# Altium schematic sheet Sheet2.SchDoc
size A3
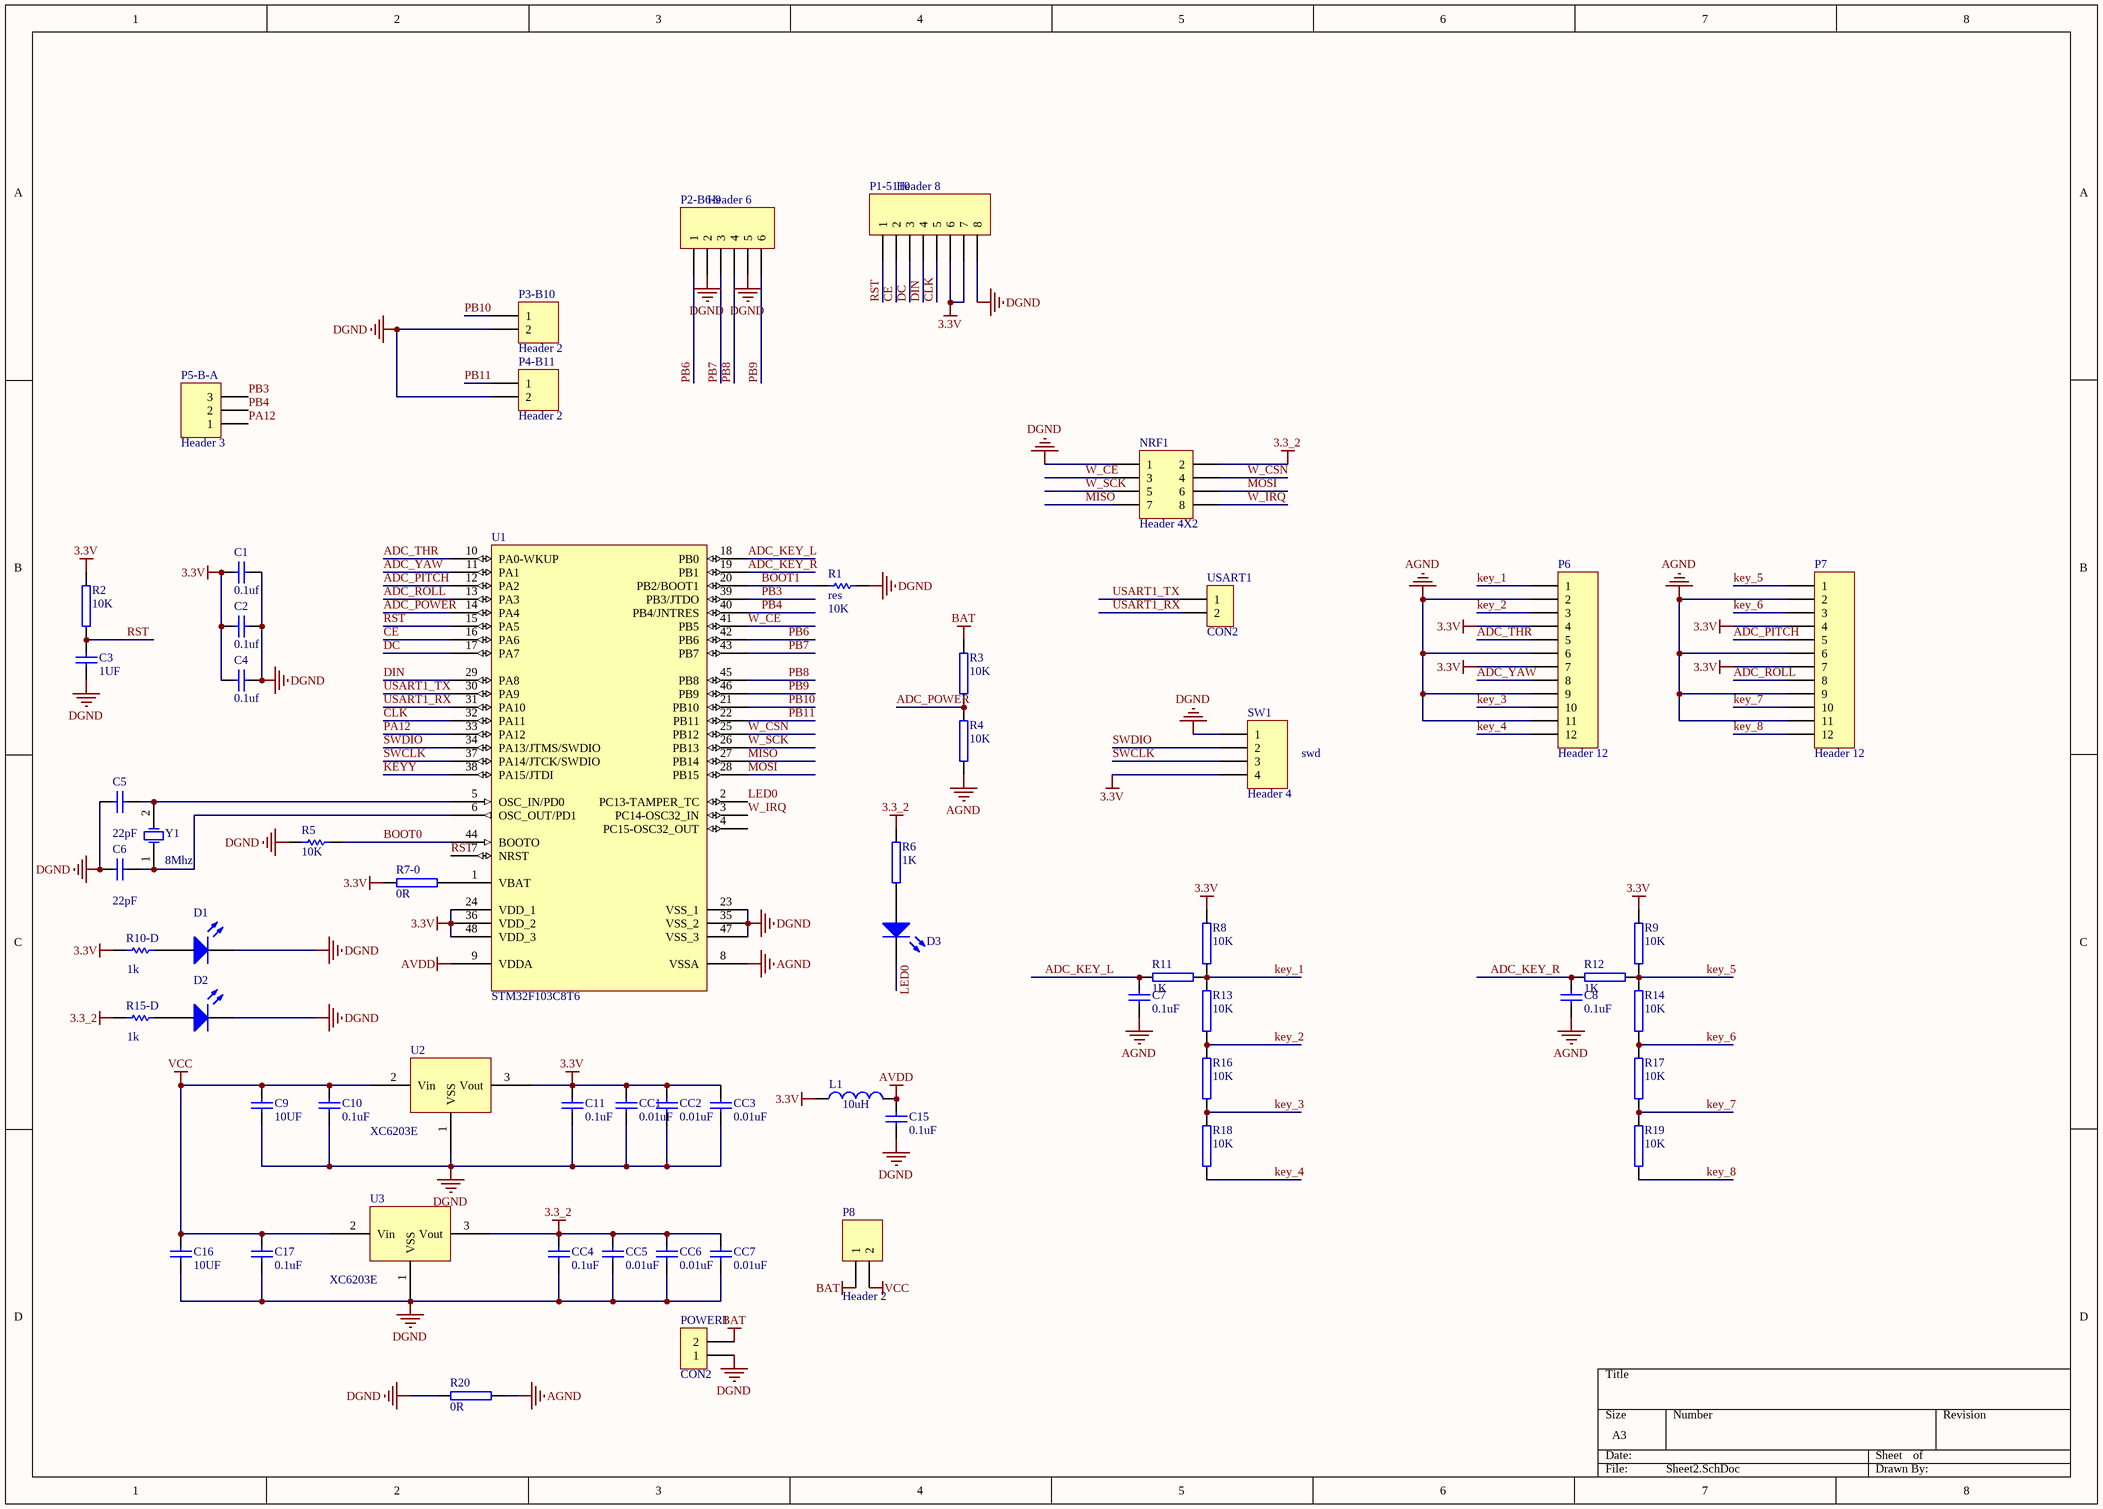
[diagram p0: Sheet2.SchDoc]

## Parts
C1  value 0.1uf  [0603c]  (hidden comment: cap)
C2  value 0.1uf  [0603c]  (hidden comment: cap)
C3  value 1UF  [0603c]  (hidden comment: cap)
C4  value 0.1uf  [0603c]  (hidden comment: cap)
C5  value 22pF  [0603c]  (hidden comment: cap)
C6  value 22pF  [0603c]  (hidden comment: cap)
C7  value 0.1uF  [0603c]  (hidden comment: cap)
C8  value 0.1uF  [0603c]  (hidden comment: cap)
C9  value 10UF  [0805]  (hidden comment: cap)
C10  value 0.1uF  [0603c]  (hidden comment: cap)
C11  value 0.1uF  [0603c]  (hidden comment: cap)
C15  value 0.1uF  [0603c]  (hidden comment: cap)
C16  value 10UF  [0805]  (hidden comment: cap)
C17  value 0.1uF  [0603c]  (hidden comment: cap)
CC1  value 0.01uF  [0603c]  (hidden comment: cap)
CC2  value 0.01uF  [0603c]  (hidden comment: cap)
CC3  value 0.01uF  [0603c]  (hidden comment: cap)
CC4  value 0.1uF  [0603c]  (hidden comment: cap)
CC5  value 0.01uF  [0603c]  (hidden comment: cap)
CC6  value 0.01uF  [0603c]  (hidden comment: cap)
CC7  value 0.01uF  [0603c]  (hidden comment: cap)
D1  LED0  [0805]  (value not drawn)
D2  LED0  [0805]  (value not drawn)
D3  LED0  [0805]  (value not drawn)
L1  value 10uH  [0805]  (hidden comment: Inductor)
NRF1  Header 4X2  [HDR2X4]
P1-5110  Header 8  [HDR1X8]
P2-B6-9  Header 6  [6p]
P3-B10  Header 2  [2p]
P4-B11  Header 2  [2p]
P5-B-A  Header 3  [HDR1X3]
P6  Header 12  [12p]
P7  Header 12  [12p]
P8  Header 2  [2p]
POWER1  CON2  [2p]
R1  res  res: 10K  [0603c]
R2  10K  [0603c]
R3  10K  [0603c]
R4  10K  [0603c]
R5  res: 10K  [0603c]  (hidden comment: res)
R6  1K  [0603c]
R7-0  0R  [0805]
R8  10K  [0603c]
R9  10K  [0603c]
R10-D  res: 1k  [0603c]  (hidden comment: res)
R11  1K  [0603c]
R12  1K  [0603c]
R13  10K  [0603c]
R14  10K  [0603c]
R15-D  res: 1k  [0603c]  (hidden comment: res)
R16  10K  [0603c]
R17  10K  [0603c]
R18  10K  [0603c]
R19  10K  [0603c]
R20  0R  [0805]
SW1  Header 4  [HDR1X4]
U1  STM32F103C8T6  [LQFP48S]
U2  XC6203E  [SOT-89]
U3  XC6203E  [SOT-89]
USART1  CON2  [SIP2]
Y1  5032xtal  [晶振]  (value not drawn)

## Nets
3.3_2: CC4.2 CC5.2 CC6.2 CC7.2 NRF1.2 R6.2 R15-D.1 U3.3(Vout)
3.3V: C1.2 C2.2 C4.2 C11.2 CC1.2 CC2.2 CC3.2 L1.1 P1-5110.6 P1-5110.7 P6.4 P6.7 P7.4 P7.7 R2.2 R7-0.2 R8.2 R9.2 R10-D.1 SW1.4 U1.24(VDD_1) U1.36(VDD_2) U1.48(VDD_3) U2.3(Vout)
AGND: C7.1 C8.1 P6.2 P6.6 P6.9 P6.11 P7.2 P7.6 P7.9 P7.11 R4.1 R20.2 U1.8(VSSA)
AVDD: C15.2 L1.2 U1.9(VDDA)
BAT: P8.1 POWER1.2 R3.2
DGND: C1.1 C2.1 C3.1 C4.1 C5.1 C6.1 C9.1 C10.1 C11.1 C15.1 C16.1 C17.1 CC1.1 CC2.1 CC3.1 CC4.1 CC5.1 CC6.1 CC7.1 D1.2(K) D2.2(K) NRF1.1 P1-5110.8 P2-B6-9.2 P2-B6-9.5 P3-B10.2 P4-B11.2 POWER1.1 R1.2 R5.1 R20.1 SW1.1 U1.23(VSS_1) U1.35(VSS_2) U1.47(VSS_3) U2.1(VSS) U3.1(VSS)
VCC: C9.2 C10.2 C16.2 C17.2 P8.2 U2.2(Vin) U3.2(Vin)
ADC_KEY_L: C7.2 R11.2 U1.18(PB0)
ADC_KEY_R: C8.2 R12.2 U1.19(PB1)
ADC_PITCH: P7.5 U1.12(PA2)
ADC_POWER: R3.1 R4.2 U1.14(PA4)
ADC_ROLL: P7.8 U1.13(PA3)
ADC_THR: P6.5 U1.10(PA0-WKUP)
ADC_YAW: P6.8 U1.11(PA1)
BOOT0: R5.2 U1.44(BOOTO)
BOOT1: R1.1 U1.20(PB2/BOOT1)
CE: P1-5110.2 U1.16(PA6)
CLK: P1-5110.5 U1.32(PA11)
DC: P1-5110.3 U1.17(PA7)
DIN: P1-5110.4 U1.29(PA8)
key_1: P6.1 R8.1 R11.1 R13.2
key_2: P6.3 R13.1 R16.2
key_3: P6.10 R16.1 R18.2
key_4: P6.12 R18.1
key_5: P7.1 R9.1 R12.1 R14.2
key_6: P7.3 R14.1 R17.2
key_7: P7.10 R17.1 R19.2
key_8: P7.12 R19.1
KEYY: U1.38(PA15/JTDI)
LED0: D3.2(K) U1.2(PC13-TAMPER_TC)
MISO: NRF1.7 U1.27(PB14)
MOSI: NRF1.6 U1.28(PB15)
PA12: P5-B-A.1 U1.33(PA12)
PB3: P5-B-A.3 U1.39(PB3/JTDO)
PB4: P5-B-A.2 U1.40(PB4/JNTRES)
PB6: P2-B6-9.1 U1.42(PB6)
PB7: P2-B6-9.3 U1.43(PB7)
PB8: P2-B6-9.4 U1.45(PB8)
PB9: P2-B6-9.6 U1.46(PB9)
PB10: P3-B10.1 U1.21(PB10)
PB11: P4-B11.1 U1.22(PB11)
RST: C3.2 P1-5110.1 R2.1 U1.7(NRST) U1.15(PA5)
SWCLK: SW1.3 U1.37(PA14/JTCK/SWDIO)
SWDIO: SW1.2 U1.34(PA13/JTMS/SWDIO)
USART1_RX: U1.31(PA10) USART1.2
USART1_TX: U1.30(PA9) USART1.1
W_CE: NRF1.3 U1.41(PB5)
W_CSN: NRF1.4 U1.25(PB12)
W_IRQ: NRF1.8 U1.3(PC14-OSC32_IN)
W_SCK: NRF1.5 U1.26(PB13)
NetC5_2: C5.2 U1.5(OSC_IN/PD0) Y1.2(OSC2)
NetC6_2: C6.2 U1.6(OSC_OUT/PD1) Y1.1(OSC1)
NetD1_1: D1.1(A) R10-D.2
NetD2_1: D2.1(A) R15-D.2
NetD3_1: D3.1(A) R6.1
NetR7-0_1: R7-0.1 U1.1(VBAT)

Not connected (* = marked no-connect by the designer): U1 4(PC15-OSC32_OUT)

## Notes on the sheet
- swd
- (in symbol 5032xtal) 8Mhz

## Library data of the parts
D1-D3 = LED0: Typical INFRARED GaAs LED; Published: 8-Jun-2000; LatestRevisionDate: 08-Jul-2005; LatestRevisionNote: Mech Layer 1 removed.; PackageReference: LED-0; Publisher: Altium Limited
NRF1 = Header 4X2: Header, 4-Pin, Dual row; LatestRevisionDate: 17-Jul-2002; LatestRevisionNote: Re-released for DXP Platform.; Publisher: Altium Limited
P1-5110 = Header 8: Header, 8-Pin; LatestRevisionDate: 17-Jul-2002; LatestRevisionNote: Re-released for DXP Platform.; Publisher: Altium Limited
P2-B6-9 = Header 6: Header, 6-Pin; LatestRevisionDate: 17-Jul-2002; LatestRevisionNote: Re-released for DXP Platform.; Publisher: Altium Limited
P3-B10 P4-B11 P8 = Header 2: Header, 2-Pin; LatestRevisionDate: 17-Jul-2002; LatestRevisionNote: Re-released for DXP Platform.; Publisher: Altium Limited
P5-B-A = Header 3: Header, 3-Pin; LatestRevisionDate: 17-Jul-2002; LatestRevisionNote: Re-released for DXP Platform.; Publisher: Altium Limited
P6 P7 = Header 12: Header, 12-Pin; LatestRevisionDate: 17-Jul-2002; LatestRevisionNote: Re-released for DXP Platform.; Publisher: Altium Limited
R2-R4 R6 R7-0 R8 R9 R11-R14 R16-R20 = RES
SW1 = Header 4: Header, 4-Pin; LatestRevisionDate: 17-Jul-2002; LatestRevisionNote: Re-released for DXP Platform.; Publisher: Altium Limited
U2 U3 = XC6203